# EAGLE design signal conditioner (EAGLE 6.2)
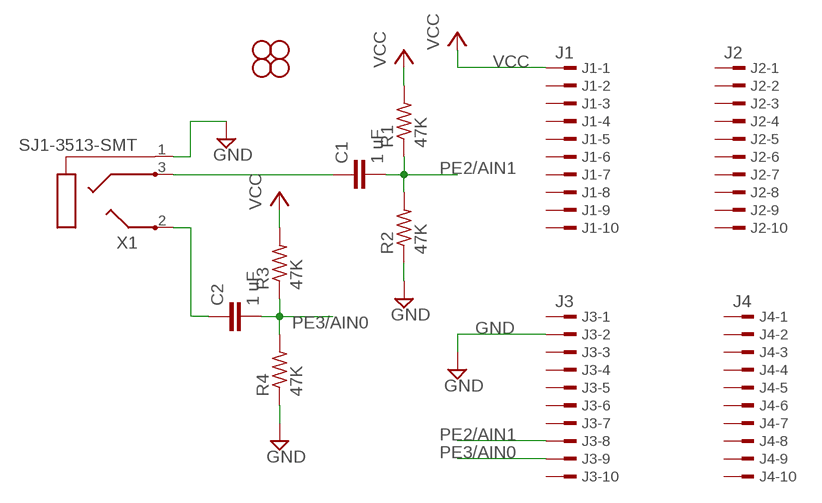
[diagram p0: schematic, sheet 1]

## Parts
C1  1 uF  C-EU050-025X075  [C050-025X075]
C2  1 uF  C-EU050-025X075  [C050-025X075]
J1  J1  TSW-110-02-S-S  [TSW-110-02-S-S]
J2  J2  TSW-110-02-S-S  [TSW-110-02-S-S]
J3  J3  TSW-110-02-S-S  [TSW-110-02-S-S]
J4  J4  TSW-110-02-S-S  [TSW-110-02-S-S]
JP1  STAND-OFF  [STAND-OFF]
JP2  STAND-OFF  [STAND-OFF]
JP3  STAND-OFF  [STAND-OFF]
JP4  STAND-OFF  [STAND-OFF]
R1  47K  R-US_0207/7  [0207/7]
R2  47K  R-US_0207/7  [0207/7]
R3  47K  R-US_0207/7  [0207/7]
R4  47K  R-US_0207/7  [0207/7]
X1  SJ1-3513-SMT  [3513]

## Nets
GND: J3.2 R2.1 R4.1 X1.1(EARTH)
N$1: C1.1 X1.3(RING)
N$2: C2.1 X1.2(TIP)
PE2/AIN1: C1.2 J3.8 R1.1 R2.2
PE3/AIN0: C2.2 J3.9 R3.1 R4.2
VCC: J1.1 R1.2 R3.2
Unconnected: J1.2 J1.3 J1.4 J1.5 J1.6 J1.7 J1.8 J1.9 J1.10 J2.1 J2.2 J2.3 J2.4 J2.5 J2.6 J2.7 J2.8 J2.9 J2.10 J3.1 J3.3 J3.4 J3.5 J3.6 J3.7 J3.10 J4.1 J4.2 J4.3 J4.4 J4.5 J4.6 J4.7 J4.8 J4.9 J4.10

## Library data of the parts
C1 C2 = rcl:C-EU: CAPACITOR, European symbol
J1-J4 = con-samtec:TSW-110-02-S-S: THROUGH-HOLE .025" SQ POST HEADER Source: Samtec TSW.pdf; OC_FARNELL: unknown; OC_NEWARK: unknown
JP1-JP4 = SparkFun:STAND-OFF: Stand Off This is the mechanical footprint for a #4 phillips button head screw. Use the keepout ring to avoid running the screw head into surrounding components. SKU : PRT-00447
R1-R4 = resistor:R-US_: RESISTOR, American symbol
X1 = eup:SJ1-3513-SMT: CONN JACK STEREO 3POS 3.5MM SMD

## Board
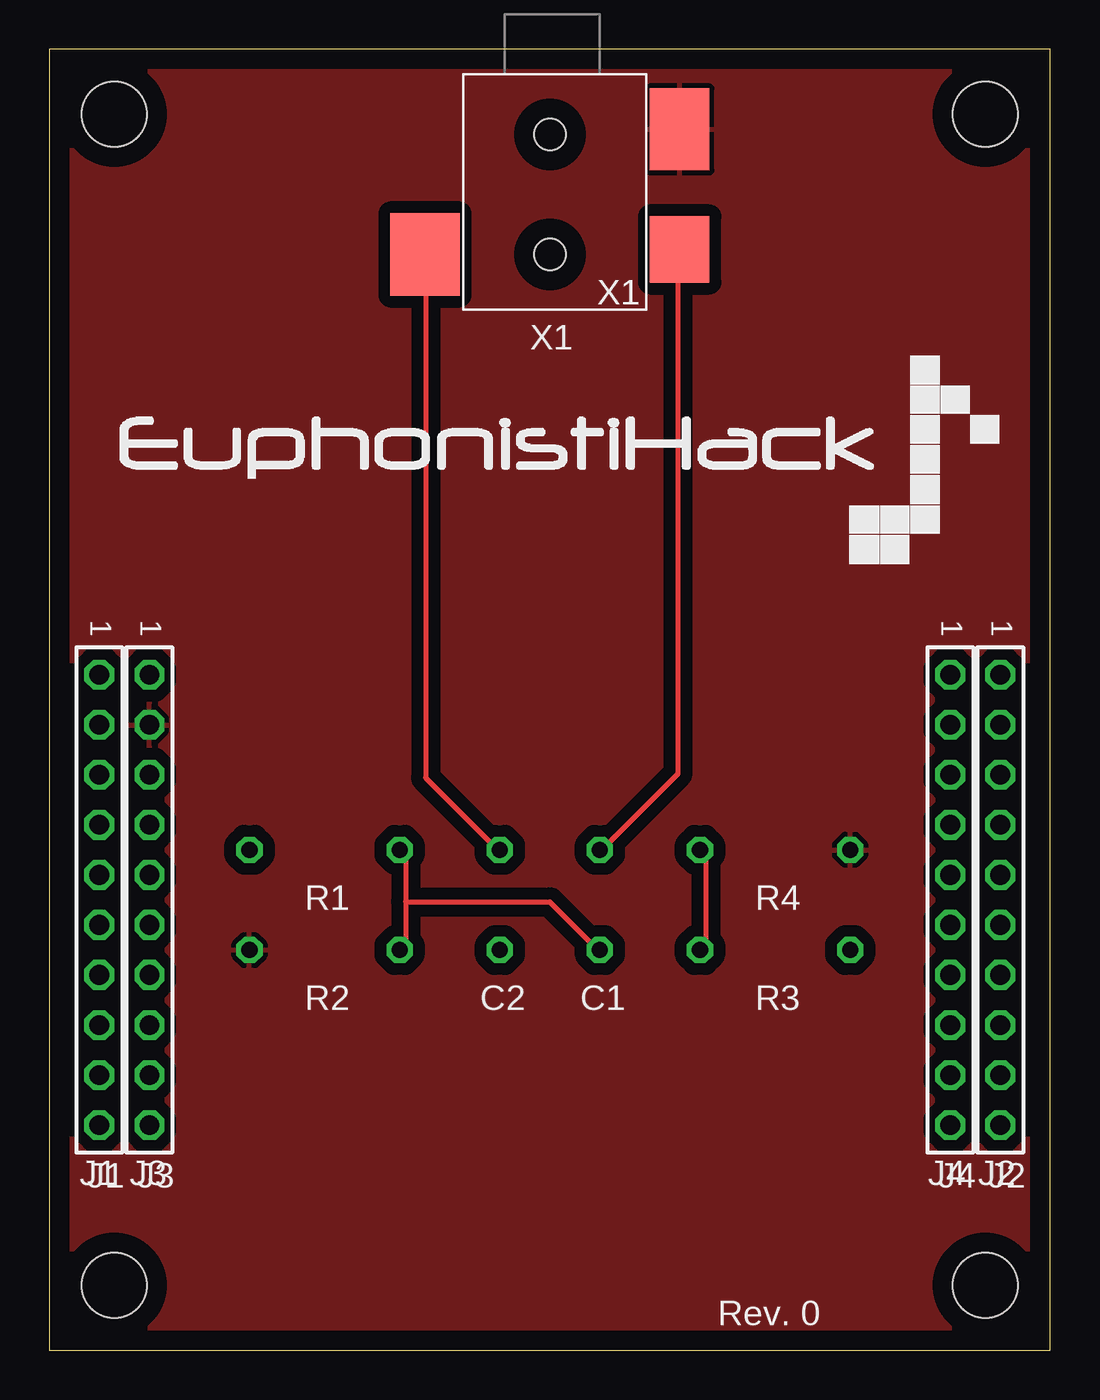
[diagram p1: board, top side]
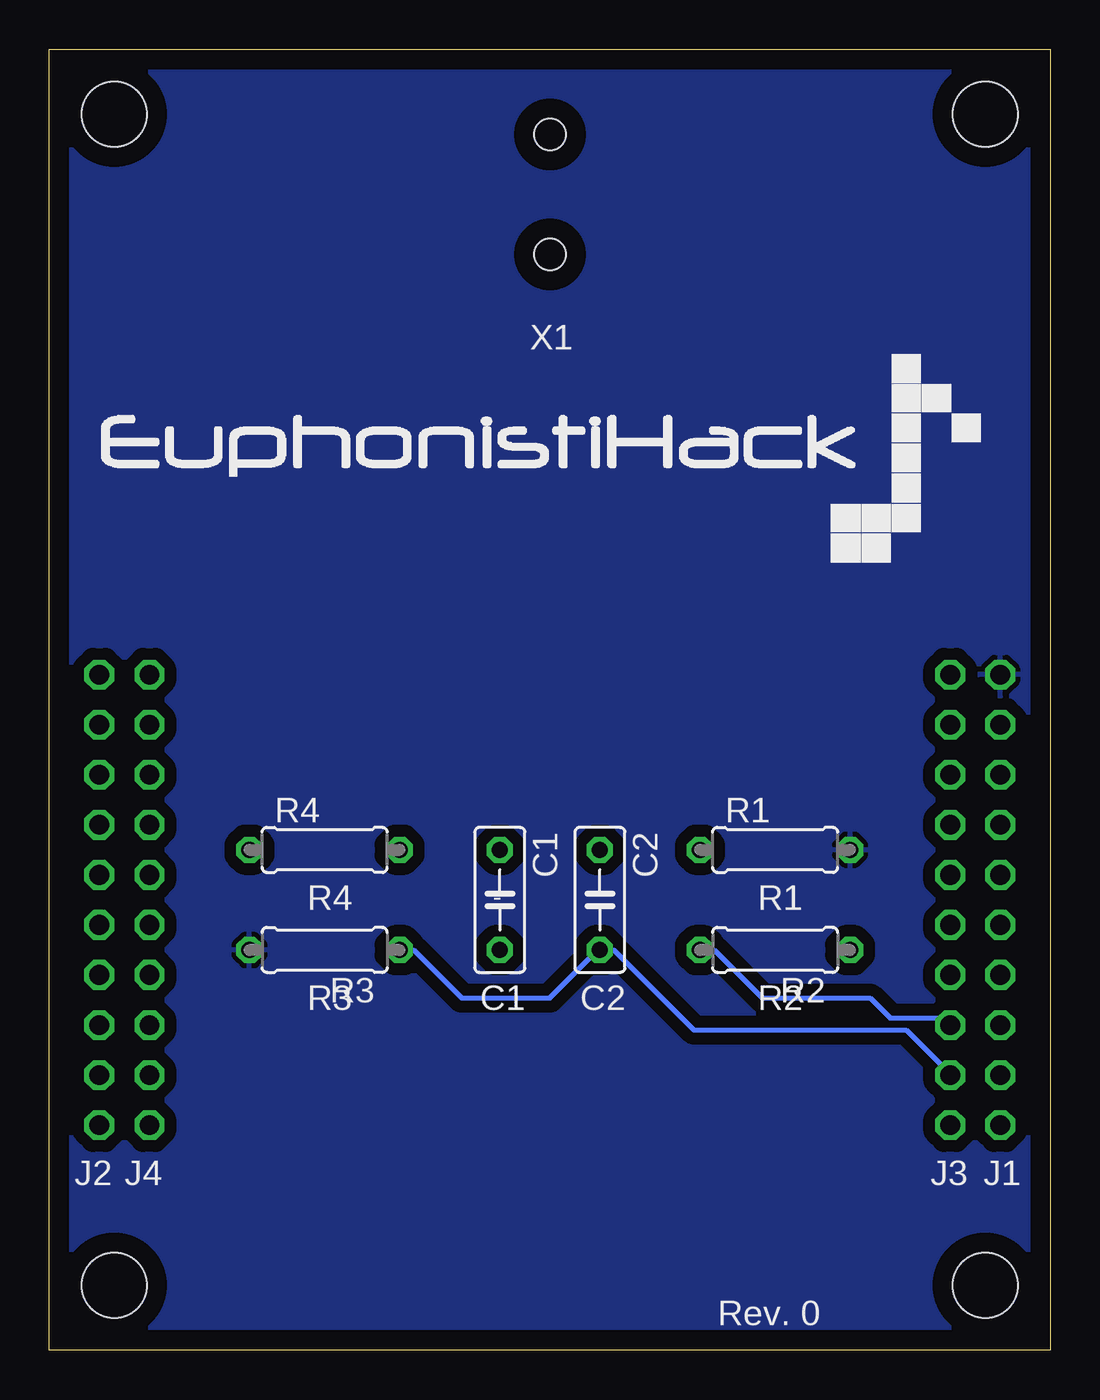
[diagram p2: board, bottom side, seen from below]

Size 50.8 x 66.04 mm. Coordinates in mm from the lower left corner, seen from the top.
Outline: 0,0 50.8,0 50.8,66.04 0,66.04 0,0
Copper layers (1*16): Top 0.035mm / dielectric 1.5mm / Bottom 0.035mm
Design rules: minimum track width 10mil, minimum drill 24mil, track to track 8mil, track to pad 8mil, pad to pad 8mil, via to via 8mil, smd to smd 8mil, copper to edge 40mil, drill to drill 8mil, minimum pad ring 10mil, minimum via ring 8mil, stop-mask expansion 4mil, vias tented up to drill 0mil, thermal gap 10mil

### Footprints (pad centres in the part's own frame; a part is rotated, then mirrored left to right if it is on the bottom)
C050-025X075 = drill 0.813 octagon: 1 -2.54,0; 2 2.54,0
TSW-110-02-S-S = drill 1 pad 1.5 octagon: 1 11.43,0; 2 8.89,0; 3 6.35,0; 4 3.81,0; 5 1.27,0; 6 -1.27,0; 7 -3.81,0; 8 -6.35,0; 9 -8.89,0; 10 -11.43,0
STAND-OFF = hole 3.302: 0,0
0207/7 = drill 0.813 octagon: 1 -3.81,0; 2 3.81,0
3513 = smd 4.17 x 3.02: 1 2.794,6.59 | smd 4.17 x 3.52: 2 9.144,-6.332 | smd 3.37 x 3.02: 3 8.89,6.59 | hole 1.6: 3.048,0; 9.144,0

### Placement (x,y rotation side)
C1  27.94,22.86 270 bottom
C2  22.86,22.86 270 bottom
J1  2.54,22.86 90 top
J2  48.26,22.86 90 top
J3  5.08,22.86 90 top
J4  45.72,22.86 90 top
JP1  3.3,62.74 0 top
JP2  47.5,62.74 0 top
JP3  3.3,3.3 0 top
JP4  47.5,3.3 0 top
R1  13.97,25.4 0 bottom
R2  13.97,20.32 180 bottom
R3  36.83,20.32 180 bottom
R4  36.83,25.4 0 bottom
X1  25.4,64.77 270 top

### Tracks (layer width: path | path; a pad name or v marks a point on that pad's centre or on a via)
GND
  pour Top (isolate 0.61): 0,66.04 50.8,66.04 50.8,0 0,0
N$1
  Top 0.254: C1.1 28.04,25.4 31.9,29.26 31.9,55.88 X1.3
N$2
  Top 0.254: C2.1 22.76,25.4 19.1,29.06 19.1,55.47 X1.2
PE2/AIN1
  Top 0.254: 18.09,22.76 18.09,25.2 17.88,25.4 R1.1 | 18.09,22.76 18.09,20.52 17.88,20.32 R2.2 | 18.09,22.76 25.4,22.76 27.84,20.32 C1.2
  Bottom 0.254: R2.2 17.07,20.32 14.63,17.88 9.14,17.88 8.13,16.87 5.28,16.87 5.08,16.66 J3.8
PE3/AIN0
  Top 0.254: R4.2 33.12,25.4 33.33,25.2 33.33,20.52 33.12,20.32 R3.1
  Bottom 0.254: R3.1 32.31,20.32 29.87,17.88 25.4,17.88 22.96,20.32 C2.2 22.15,20.32 18.09,16.26 7.32,16.26 5.08,14.02 J3.9
VCC
  pour Bottom (isolate 0.61): 0,66.04 50.8,66.04 50.8,0 0,0

### Text on the board
tPlace: X1 | R1 | R4 | R2 | C2 | C1 | R3 | J1 | J3 | J4 | J2 | Rev. 0
bPlace: X1 | R1 | R4 | R2 | C2 | C1 | R3 | J1 | J3 | J4 | J2 | Rev. 0